# Altium schematic sheet P04_USB.SchDoc
size B; SheetNumber: 4; SheetTotal: 6
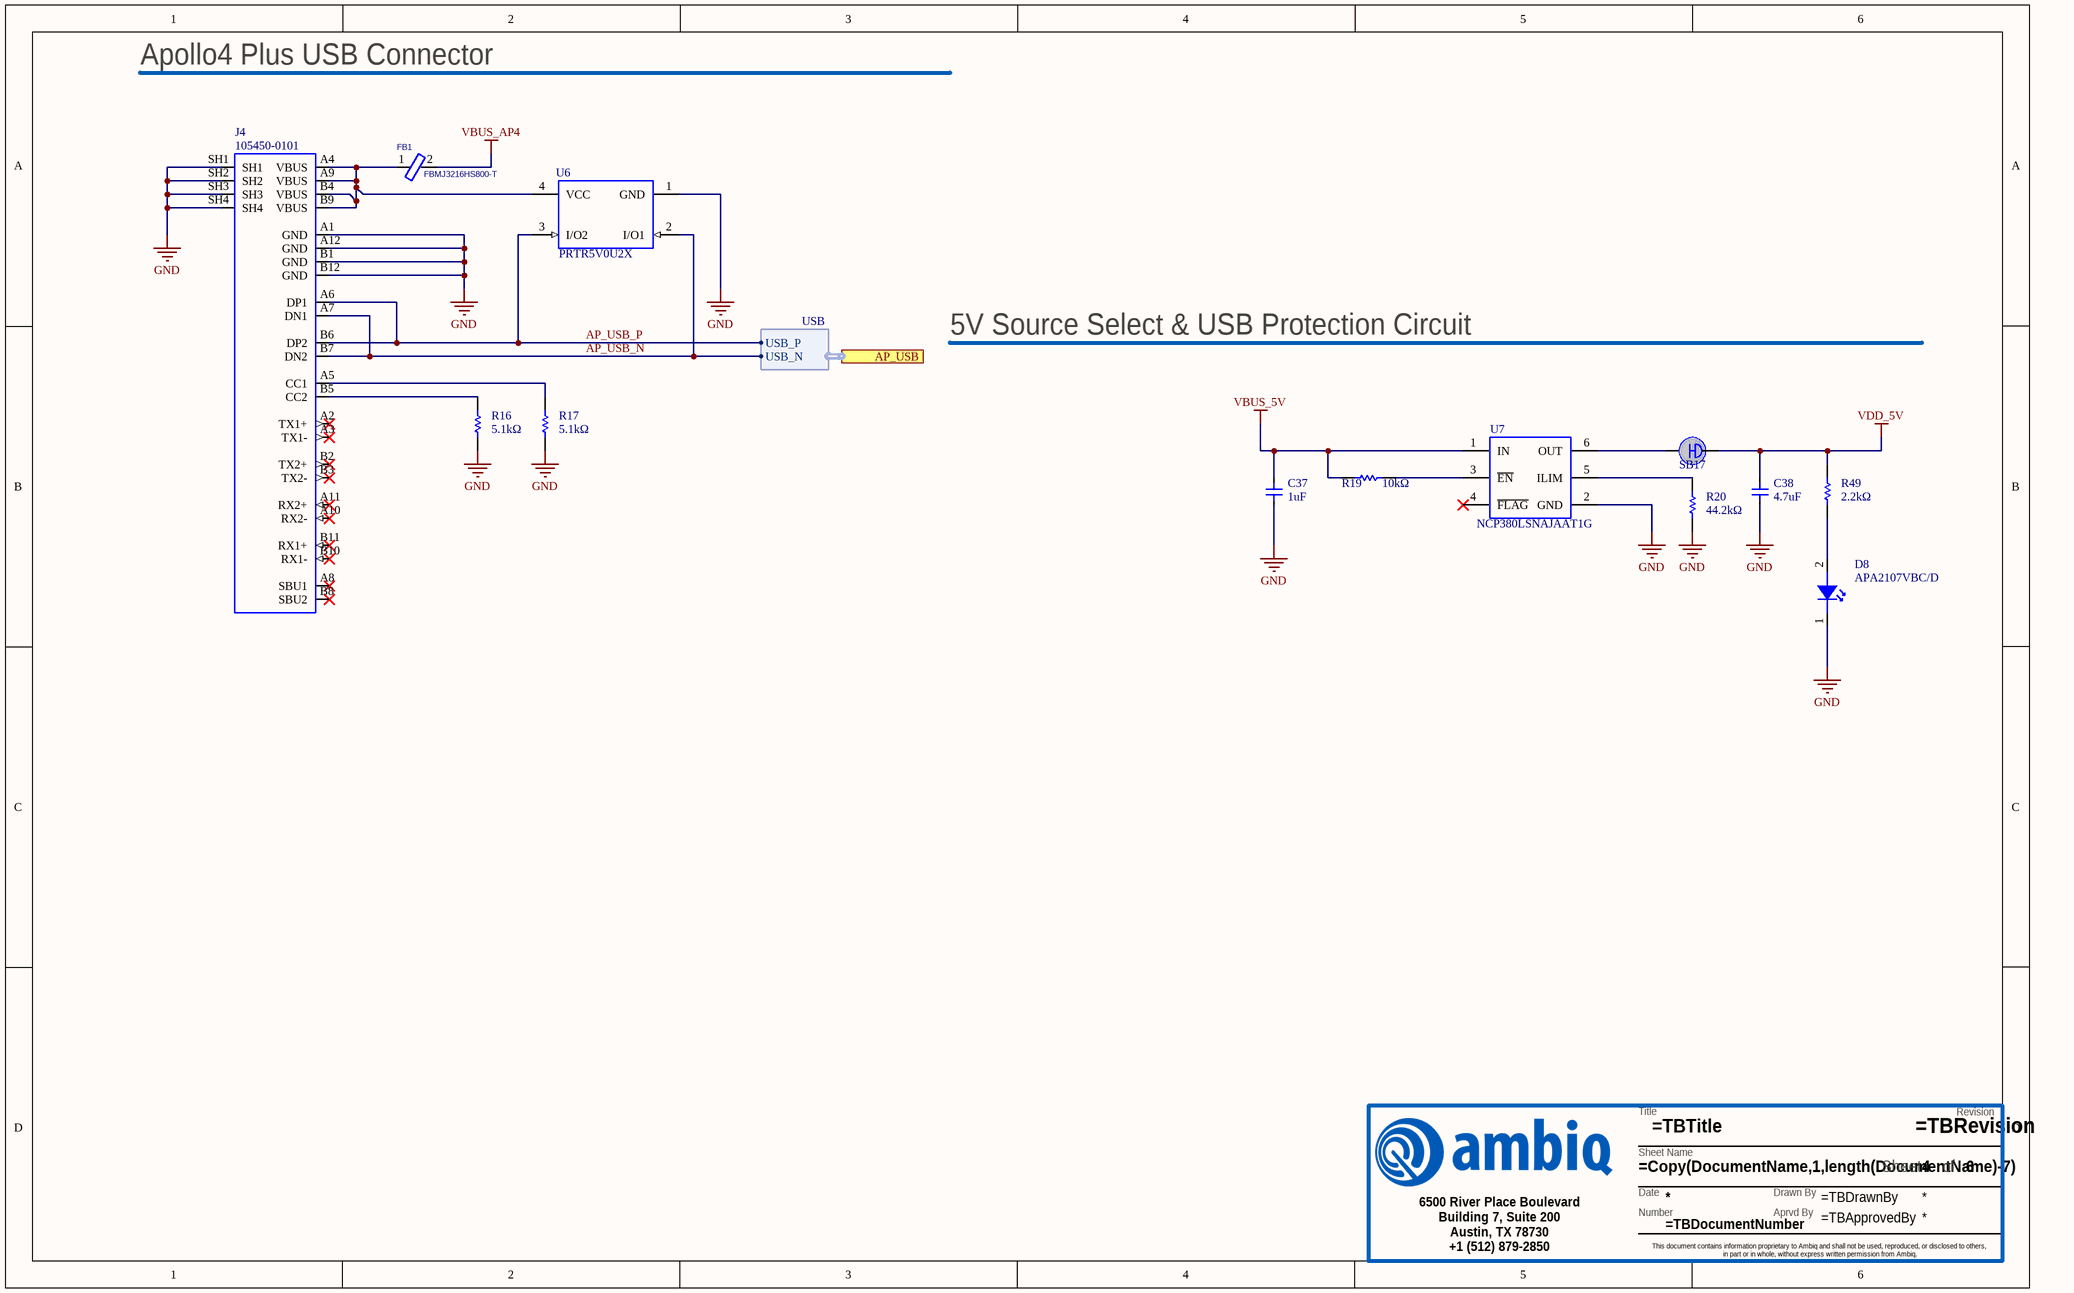
[diagram p0: P04_USB.SchDoc]

## Parts
?  TitleBlock  (value not drawn)  (graphical)
C37  1uF  [IPC_A]
C38  4.7uF  [IPC_A]
D8  APA2107VBC/D  [2106_LED_RA]
FB1  FBMJ3216HS800-T  [IPC_A]
J4  105450-0101  [CON24_C_USB_RA_TH]
R16  5.1kΩ  [IPC_A]
R17  5.1kΩ  [IPC_A]
R19  10kΩ  [IPC_A]
R20  44.2kΩ  [IPC_A]
R49  2.2kΩ  [IPC_A]
SB17  Solder short  [SB39X18_SHORTED]  (value not drawn)  (net tie, no BOM)
U6  PRTR5V0U2X  [SOT143L]
U7  NCP380LSNAJAAT1G  [TSOP6_1P70X3P10_ONS]

## Ports
AP_USB (harness USB)

## Harnesses
USB: USB_N, USB_P

## Nets
GND: C37.2 C38.2 D8.1(C) J4.A1(GND) J4.A12(GND) J4.B1(GND) J4.B12(GND) J4.SH1 J4.SH2 J4.SH3 J4.SH4 R16.1 R17.1 R20.1 U6.1(GND) U7.2(GND)
VBUS_5V: C37.1 R19.1 U7.1(IN)
VBUS_AP4: FB1.2
VDD_5V: C38.1 R49.2 SB17.2
AP_USB_N: J4.A7(DN1) J4.B7(DN2) U6.2(I/O1) ; port AP_USB.USB_N
AP_USB_P: J4.A6(DP1) J4.B6(DP2) U6.3(I/O2) ; port AP_USB.USB_P
NetD8_2: D8.2(A) R49.1
NetFB1_1: FB1.1 J4.A4(VBUS) J4.A9(VBUS) J4.B4(VBUS) J4.B9(VBUS) U6.4(VCC)
NetJ4_A5: J4.A5(CC1) R17.2
NetJ4_B5: J4.B5(CC2) R16.2
NetR19_2: R19.2 U7.3(~{EN})
NetR20_2: R20.2 U7.5(ILIM)
NetSB17_1: SB17.1 U7.6(OUT)

Not connected (* = marked no-connect by the designer): J4 A2(TX1+)* A3(TX1-)* A8(SBU1)* A10(RX2-)* A11(RX2+)* B2(TX2+)* B3(TX2-)* B8(SBU2)* B10(RX1-)* B11(RX1+)*; U7 4(~{FLAG})*

## Notes on the sheet
- Apollo4 Plus USB Connector
- 5V Source Select & USB Protection Circuit
- (in symbol TitleBlock) Revision; Title; Sheet Name; Sheet; of; Date; Drawn By; Number; Aprvd By; 6500 River Place Boulevard / Building 7, Suite 200 / Austin, TX 78730 / +1 (512) 879-2850; This document contains information proprietary to Ambiq and shall not be used, reproduced, or disclosed to others, / in part or in whole, without express written permission from Ambiq.

## Library data of the parts
? = TitleBlock: Title block for Ambiq Schematics. Please have the following parameters entered in Project>Project Options>Parameters: / TBTitle / TBDocumentNumber / TBRevision / TBDrawnBy / TBApprovedBy; AMBIQ PN: TitleBlock
C37 = CL05A105MP5NNNC: NONE; Manufacturer: Samsung; Tolerance: 20%; Voltage Rating: 10V; Dielectric: X5R; AMBIQ PN: CL05A105MP5NNNC; Supplier 1: Newark; Supplier Part Number 1: 82AC9187; Manufacturer Part Number: CL05A105MP5NNNC; RoHS: Yes; Category: Ceramic Capacitors; Pricing 1: 50000=0.10000 (USD); Mount: Surface Mount; Case/Package: 0402; Case Code (Metric): 1005; Case Code (Imperial): 0402; Min Operating Temperature: -55°C; Max Operating Temperature: 85°C; Capacitance: 1uF; Packaging: Tape and Reel; Voltage Rating (DC): 10V; Series: CL; Construction: Flat; Length: 1mm; Width: 0.02inch; Height: 0.5mm; Thickness: 0.022inch; Depth: 0.5mm; Radiation Hardening: No; Lead Free: Lead Free; RoHS Compliant: Yes; ComponentLink1URL: https://datasheet.ciiva.com/25802/cl05a105mp5nnnc-25802049.pdf?src-supplier=Digi-Key; ComponentLink1Description: https://datasheet.ciiva.com/25802/cl05a105mp5nnnc-25802049.pdf?src-supplier=Digi-Key; Package Quantity: 1
C38 = GRM155R60G475ME87D: NONE; Manufacturer: Murata; Tolerance: 20%; Voltage Rating: 4V; Dielectric: X5R; AMBIQ PN: GRM155R60G475ME87D; Supplier 1: Arrow Electronics; Supplier Part Number 1: GRM155R60G475ME87D; Manufacturer Part Number: GRM155R60G475ME87D; RoHS: Yes; Category: Ceramic Capacitors; Stock 1: 79890; Pricing 1: 1=0.12440, 10=0.07530, 25=0.07460, 100=0.04310, 250=0.04270, 500=0.02940, 1000=0.02580, 3000=0.02370, 6000=0.02210, 15000=0.021; Mount: Surface Mount; Case/Package: 0402; Case Code (Metric): 1005; Case Code (Imperial): 0402; Min Operating Temperature: -55°C; Max Operating Temperature: 85°C; Capacitance: 4.7uF; Packaging: Tape and Reel; Voltage: 4V; Voltage Rating (DC): 4V; Series: GRM; Construction: Flat; Length: 1mm; Width: 0.02inch; Height: 0.5mm; Thickness: 0.026inch; Depth: 0.5mm; Radiation Hardening: No; REACH SVHC: No SVHC; Lead Free: Lead Free; RoHS Compliant: Yes; ComponentLink1URL: https://datasheet.ciiva.com/11613/c02e-11613181.pdf?src-supplier=Avnet; ComponentLink1Description: https://datasheet.ciiva.com/11613/c02e-11613181.pdf?src-supplier=Avnet
D8 = APA2107VBC/D: None; Manufacturer: Kingbright; Forward Voltage: 3.3V; Color: Blue; Lens Color: Colorless; Luminous Intensity: 200mcd; Viewing Angle: 120°; Lens Style: Domed; Lens Transparency: Clear; Test Current: 20mA; Dominant Wavelength: 470nm; Lens Size: 0.6mm; AMBIQ PN: APA2107VBC/D; Supplier 1: Digi-Key; Supplier Part Number 1: 754-2102-1-ND; Manufacturer Part Number: APA2107VBC/D; RoHS: Yes; Category: LEDs; Stock 1: 6712; Pricing 1: 1=0.61000, 10=0.37500, 100=0.21560, 1000=0.16871 (USD); Case/Package: SMD/SMT; Packaging: Tape and Reel; Length: 2.1mm; Width: 1mm; Height: 0.7mm; RoHS Compliant: Yes; ComponentLink1URL: http://www.kingbrightusa.com/images/catalog/SPEC/APA2107VBC-D.pdf?src-supplier=Digi-Key; ComponentLink1Description: http://www.kingbrightusa.com/images/catalog/SPEC/APA2107VBC-D.pdf?src-supplier=Digi-Key; Mount: Surface Mount
FB1 = FBMJ3216HS800-T: NONE; Manufacturer: Taiyo Yuden; Impedance: 80R; Tolerance: 25%; DC Resistance (DCR): 10mR; Max DC Current: 4A; Number of Lines: 1; Test Frequency: 100MHz; Shielding: Unshielded; AMBIQ PN: FBMJ3216HS800-T; Supplier 1: Newark; Supplier Part Number 1: 86H5353; Manufacturer Part Number: FBMJ3216HS800-T; RoHS: Yes; Category: Ferrite Beads and Chips; Stock 1: 265; Pricing 1: 1=0.30000, 10=0.20700, 25=0.17700, 50=0.14800, 100=0.11800 (USD); ComponentLink1URL: https://datasheet.ciiva.com/5709/chipbeads01-e-5709344.pdf?src-supplier=Farnell; ComponentLink1Description: https://datasheet.ciiva.com/5709/chipbeads01-e-5709344.pdf?src-supplier=Farnell; Mount: Surface Mount; Case/Package: 1206; Number of Pins: 2; Core Material: Ferrite; Case Code (Metric): 3216; Case Code (Imperial): 1206; Material: Ferrite; Min Operating Temperature: -40°C; Max Operating Temperature: 125°C; Packaging: Tape and Reel; Resistance: 10mR; Package Quantity: 1; Max Current Rating: 4A; Termination: SMD/SMT; Frequency: 100MHz; Series: FB; Resistor Type: Ferrite Bead; Length: 3.2mm; Width: 0.063inch; Height: 1.3mm; Depth: 1.8mm; Lead Free: Lead Free; Halogen Free: Halogen Free; REACH SVHC: No SVHC; ComponentLink2URL: https://datasheet.ciiva.com/16001/202fbmj3216hs800-t-16001070.pdf?src-supplier=Onlinecomponents.com; ComponentLink2Description: https://datasheet.ciiva.com/16001/202fbmj3216hs800-t-16001070.pdf?src-supplier=Onlinecomponents.com; ComponentLink3URL: https://datasheet.ciiva.com/30088/23fbmj3216hs800-t-30088710.pdf?src-supplier=Onlinecomponents.com; ComponentLink3Description: https://datasheet.ciiva.com/30088/23fbmj3216hs800-t-30088710.pdf?src-supplier=Onlinecomponents.com; ComponentLink4URL: https://datasheet.ciiva.com/23606/fbmj3216hs800-t-ss-23606768.pdf?src-supplier=Newark; ComponentLink4Description: https://datasheet.ciiva.com/23606/fbmj3216hs800-t-ss-23606768.pdf?src-supplier=Newark; ComponentLink5URL: https://datasheet.ciiva.com/25614/0900766b810b37be-25614395.pdf?src-supplier=RSComponents; ComponentLink5Description: https://datasheet.ciiva.com/25614/0900766b810b37be-25614395.pdf?src-supplier=RSComponents; ComponentLink6URL: https://datasheet.ciiva.com/6212/chipbeads01-e-6212909.pdf?src-supplier=Digi-Key; ComponentLink6Description: https://datasheet.ciiva.com/6212/chipbeads01-e-6212909.pdf?src-supplier=Digi-Key; ComponentLink7URL: https://datasheet.ciiva.com/7966/chipbeads01-e-7966171.pdf?src-supplier=Element14; ComponentLink7Description: https://datasheet.ciiva.com/7966/chipbeads01-e-7966171.pdf?src-supplier=Element14
J4 = 1054500101: NONE; Manufacturer: Molex; Number of Terminals/Pins: 24; Connector Type: USB; Gender: Receptacle; Number of Ports: 1; USB Standard: USB 3.1; Current Rating: 5A; Mating Cycles: 10000; Shielding: Shielded; Pitch: 0.5mm; AMBIQ PN: 1054500101; Supplier 1: Arrow Electronics; Supplier Part Number 1: 105450-0101; Manufacturer Part Number: 105450-0101; RoHS: Yes; Category: USB Connectors; Stock 1: 534; Pricing 1: 1=2.15670, 10=1.78070, 25=1.76290, 100=1.52500, 250=1.50710, 500=1.41880 (USD); Mount: Surface Mount,Through Hole,Horizontal; Case/Package: 0101; Number of Pins: 24; Contact Material: Copper Alloy; Contact Plating: Gold; Housing Material: Thermoplastic; Insulation Color: Black; Min Operating Temperature: -30°C; Max Operating Temperature: 85°C; Packaging: Tape and Reel; Number of Contacts: 24; Orientation: Right Angle; Termination: Solder; Features: Shielded; Length: 8.94mm; REACH SVHC: Unknown; Flammability Rating: UL94 V-0; RoHS Compliant: Yes; ComponentLink1URL: http://www.farnell.com/datasheets/2801634.pdf?src-supplier=Farnell; ComponentLink1Description: http://www.farnell.com/datasheets/2801634.pdf?src-supplier=Farnell
R16 R17 = CRCW04025K10FKED: Res Thick Film 0402 5.1K Ohm 1% 1/16W ±100ppm/°C Molded SMD SMD Paper T/R; Manufacturer: Vishay; Power Rating: 63mW; Voltage Rating: 50V; AMBIQ PN: CRCW04025K10FKED; Supplier 1: RSComponents; Supplier Part Number 1: 6789478P; Manufacturer Part Number: CRCW04025K10FKED; RoHS: Yes; Category: Chip SMD Resistors; Stock 1: 1; Pricing 1: 50=0.06400, 500=0.05900, 1000=0.05300, 2000=0.04700, 4000=0.04100 (USD); Mount: Surface Mount; Case/Package: 0402; Weight: 2.3E-05oz; Case Code (Metric): 1005; Case Code (Imperial): 0402; Contact Plating: Tin; Size Code: 0402; Min Operating Temperature: -55°C; Max Operating Temperature: 155°C; Resistance: 5.1kΩ; Package Quantity: 10; Packaging: Tape and Reel; Resistor Type: Thick Film; Number of Terminations: 2; Termination: SMD/SMT; Max Power Dissipation: 63mW; Temperature Coefficient: 100ppm/°C; Voltage Rating (DC): 50V; Features: Automotive AEC-Q200; Series: CRCW; Technology: THICK FILM; Construction: Rectangular; Length: 1mm; Width: 0.02inch; Height: 0.35mm; Depth: 0.5mm; Radiation Hardening: No; REACH SVHC: Unknown; Military Standard: Not; Lead Free: Lead Free; RoHS Compliant: Yes; ComponentLink1URL: https://datasheet.ciiva.com/11809/0900766b80d98824-11809770.pdf?src-supplier=RSComponents; ComponentLink1Description: https://datasheet.ciiva.com/11809/0900766b80d98824-11809770.pdf?src-supplier=RSComponents; ComponentLink2URL: https://datasheet.ciiva.com/2464/dcrcwe3-2464033.pdf?src-supplier=Digi-Key; ComponentLink2Description: https://datasheet.ciiva.com/2464/dcrcwe3-2464033.pdf?src-supplier=Digi-Key; ComponentLink3URL: https://datasheet.ciiva.com/2464/dcrcwe3-2464034.pdf?src-supplier=Digi-Key; Tolerance: 1%; Resistance Tolerance: 1%; ComponentLink3Description: https://datasheet.ciiva.com/2464/dcrcwe3-2464034.p; ComponentLink4URL: https://datasheet.ciiva.com/2464/dcrcwe3-2464035.p; ComponentLink4Description: https://datasheet.ciiva.com/2464/dcrcwe3-2464035.p; ComponentLink5URL: https://datasheet.ciiva.com/3256/dcrcwe3-3256680.p; ComponentLink5Description: https://datasheet.ciiva.com/3256/dcrcwe3-3256680.p; ComponentLink6URL: https://datasheet.ciiva.com/7690/1697337-7690682.p; ComponentLink6Description: https://datasheet.ciiva.com/7690/1697337-7690682.p; ComponentLink7URL: https://datasheet.ciiva.com/7690/1697337-7690683.p; ComponentLink7Description: https://datasheet.ciiva.com/7690/1697337-7690683.p; ComponentLink8URL: https://datasheet.ciiva.com/22675/1847332-22675086; ComponentLink8Description: https://datasheet.ciiva.com/22675/1847332-22675086; ComponentLink9URL: https://datasheet.ciiva.com/7172/1635184-7172981.p; ComponentLink9Description: https://datasheet.ciiva.com/7172/1635184-7172981.p
R19 = RC0402FR-0710KL: Surface Mount Thick Film Resistor, Rc Series, 10 Kohm, 62.5 Mw, - 1%, 50 V, 0402 [1005 Metric]; Manufacturer: Yageo; Resistance: 10kR; Power Rating: 62.5mW; Voltage Rating: 50V; Max Power Dissipation: 63mW; Temperature Coefficient: 100ppm/°C; AMBIQ PN: RC0402FR-0710KL; Supplier 1: Arrow Electronics; Supplier Part Number 1: RC0402FR-0710KL; Manufacturer Part Number: RC0402FR-0710KL; RoHS: Yes; Category: Chip SMD Resistors; Stock 1: 7776428; Pricing 1: 10000=0.00210 (USD); Case/Package: 0402; Case Code (Metric): 1005; Case Code (Imperial): 0402; Min Operating Temperature: -55°C; Max Operating Temperature: 155°C; Packaging: Tape and Reel; Resistor Type: Thick Film; Number of Terminations: 2; Termination: SMD/SMT; Voltage Rating (DC): 50V; Features: Moisture Resistant; Series: RC; Construction: Rectangular; Length: 1mm; Width: 0.5mm; Height: 0.32mm; Depth: 0.5mm; REACH SVHC: No SVHC; Military Standard: Not; Lead Free: Lead Free; RoHS Compliant: Yes; ComponentLink1URL: https://datasheet.ciiva.com/7660/38568-7660787.pdf?src-supplier=Element14; ComponentLink1Description: https://datasheet.ciiva.com/7660/38568-7660787.pdf?src-supplier=Element14; ComponentLink2URL: https://datasheet.ciiva.com/7849/1686128-7849814.pdf?src-supplier=Element14; ComponentLink2Description: https://datasheet.ciiva.com/7849/1686128-7849814.pdf?src-supplier=Element14; ComponentLink3URL: https://datasheet.ciiva.com/7983/1018594-7983486.pdf?src-supplier=Element14; Tolerance: 1%; Number of Pins: 2; Resistance Tolerance: 1%; Working Voltage: 50V; Lead Pitch: 0.2mm
R20 = CRCW040244K2FKED: Res Thick Film 0402 44.2K Ohm 1% 1/16W ±100ppm/°C Molded SMD SMD Paper T/R; Manufacturer: Vishay; Resistance: 44.2kR; Power Rating: 63mW; Voltage Rating: 50V; AMBIQ PN: CRCW040244K2FKED; Supplier 1: RSComponents; Supplier Part Number 1: 6789336; Manufacturer Part Number: CRCW040244K2FKED; RoHS: Yes; Category: Chip SMD Resistors; Stock 1: 1300; Pricing 1: 50=0.05000, 500=0.04600, 1000=0.04300, 2000=0.04000, 4000=0.03700 (GBP); Mount: Surface Mount; Case/Package: 0402; Weight: 2.3E-05oz; Case Code (Metric): 1005; Case Code (Imperial): 0402; Contact Plating: Tin; Size Code: 0402; Min Operating Temperature: -55°C; Max Operating Temperature: 155°C; Package Quantity: 10; Packaging: Tape and Reel; Resistor Type: Thick Film; Number of Terminations: 2; Termination: SMD/SMT; Max Power Dissipation: 63mW; Temperature Coefficient: 100ppm/°C; Voltage Rating (DC): 50V; Features: Automotive AEC-Q200; Series: CRCW; Technology: THICK FILM; Construction: Rectangular; Length: 1mm; Width: 0.5mm; Height: 0.35mm; Depth: 0.5mm; Radiation Hardening: No; REACH SVHC: Unknown; Military Standard: Not; Lead Free: Lead Free; RoHS Compliant: Yes; ComponentLink1URL: https://datasheet.ciiva.com/11809/0900766b80d98824-11809017.pdf?src-supplier=RSComponents; ComponentLink1Description: https://datasheet.ciiva.com/11809/0900766b80d98824-11809017.pdf?src-supplier=RSComponents; ComponentLink2URL: https://datasheet.ciiva.com/2463/dcrcwe3-2463784.pdf?src-supplier=Digi-Key; ComponentLink2Description: https://datasheet.ciiva.com/2463/dcrcwe3-2463784.pdf?src-supplier=Digi-Key; ComponentLink3URL: https://datasheet.ciiva.com/3256/dcrcwe3-3256534.pdf?src-supplier=Avnet; Tolerance: 1%; Number of Pins: 2; Resistance Tolerance: 1%; ComponentLink3Description: https://datasheet.ciiva.com/3256/dcrcwe3-3256534.p; ComponentLink4URL: https://datasheet.ciiva.com/2463/dcrcwe3-2463785.p; ComponentLink4Description: https://datasheet.ciiva.com/2463/dcrcwe3-2463785.p; ComponentLink5URL: https://datasheet.ciiva.com/2463/dcrcwe3-2463786.p; ComponentLink5Description: https://datasheet.ciiva.com/2463/dcrcwe3-2463786.p; ComponentLink6URL: https://datasheet.ciiva.com/3256/dcrcwe3-3256533.p; ComponentLink6Description: https://datasheet.ciiva.com/3256/dcrcwe3-3256533.p; ComponentLink7URL: https://datasheet.ciiva.com/7671/1697337-7671605.p; ComponentLink7Description: https://datasheet.ciiva.com/7671/1697337-7671605.p; ComponentLink8URL: https://datasheet.ciiva.com/7671/1697337-7671606.p; ComponentLink8Description: https://datasheet.ciiva.com/7671/1697337-7671606.p; ComponentLink9URL: https://datasheet.ciiva.com/22870/70201119-2287034; ComponentLink9Description: https://datasheet.ciiva.com/22870/70201119-2287034; ComponentLink10URL: https://datasheet.ciiva.com/16768/70201119-1676858; ComponentLink10Description: https://datasheet.ciiva.com/16768/70201119-1676858
R49 = RC0402FR-072K2L: Res Thick Film 1.0 x 0.5 mm 2.2K Ohm 1% 0.063W(1/16W) 100ppm/ C Molded SMD Paper T/R; Manufacturer: Yageo; Resistance: 2.2kR; Power Rating: 63mW; Voltage Rating: 50V; Temperature Coefficient: 100ppm/°C; AMBIQ PN: RC0402FR-072K2L; Supplier 1: Arrow Electronics; Supplier Part Number 1: RC0402FR-072K2L; Manufacturer Part Number: RC0402FR-072K2L; RoHS: Yes; Category: Chip SMD Resistors; Stock 1: 3540000; Pricing 1: 10000=0.00090 (USD); Case/Package: 0402; Weight: 2.3E-05oz; Case Code (Metric): 1005; Case Code (Imperial): 0402; Size Code: 0402; Min Operating Temperature: -55°C; Max Operating Temperature: 155°C; Packaging: Tape and Reel; Resistor Type: Thick Film; Number of Terminations: 2; Termination: SMD/SMT; Max Power Dissipation: 63mW; Features: Moisture Resistant; Series: RC; Technology: THICK FILM; Construction: Rectangular; Length: 1mm; Width: 0.5mm; Height: 0.35mm; Depth: 0.5mm; REACH SVHC: Unknown; Military Standard: Not; Lead Free: Lead Free; RoHS Compliant: Yes; ComponentLink1URL: https://datasheet.ciiva.com/11808/0900766b80c66297-11808786.pdf?src-supplier=RSComponents; ComponentLink1Description: https://datasheet.ciiva.com/11808/0900766b80c66297-11808786.pdf?src-supplier=RSComponents; ComponentLink2URL: https://datasheet.ciiva.com/7983/1018594-7983515.pdf?src-supplier=Element14; ComponentLink2Description: https://datasheet.ciiva.com/7983/1018594-7983515.pdf?src-supplier=Element14; ComponentLink3URL: https://datasheet.ciiva.com/46383/1018594-46383563.pdf?src-supplier=Element14; Tolerance: 1%; Resistance Tolerance: 1%
SB17 = SBS: None; AMBIQ PN: SBS
U6 = PRTR5V0U2X,215: None; Manufacturer: Nexperia; AMBIQ PN: PRTR5V0U2X,215; Manufacturer Part Number: PRTR5V0U2X,215; Supplier 1: Arrow Electronics; Supplier Part Number 1: PRTR5V0U2X,215; RoHS: Yes; Category: ESD and Circuit Protection ICs; Stock 1: 234000; Pricing 1: 3000=0.18050, 6000=0.16890, 15000=0.15880 (USD); RoHS Compliant: Yes; ComponentLink1URL: http://www.farnell.com/datasheets/109718.pdf?src-supplier=Farnell; ComponentLink1Description: http://www.farnell.com/datasheets/109718.pdf?src-supplier=Farnell; ComponentLink2URL: https://assets.nexperia.com/documents/data-sheet/PRTR5V0U2X.pdf?src-supplier=Digi-Key; ComponentLink2Description: https://assets.nexperia.com/documents/data-sheet/PRTR5V0U2X.pdf?src-supplier=Digi-Key
U7 = NCP380LSNAJAAT1G: None; Manufacturer: ON Semiconductor; Interface: On/Off; Number of Outputs: 1; Max Output Current: 1A; Output Configuration: High Side; Max Power Dissipation: 350mW; Current Rating: 2.1A; On-State Resistance: 70mR; On-state Resistance-Max: 110MR; Operating Supply Voltage: 5.5V; Min Input Voltage: 2.5V; Number of Inputs: 2; Turn-On Delay Time: 4ms; Turn-Off Delay Time: 3ms; AMBIQ PN: NCP380LSNAJAAT1G; Manufacturer Part Number: NCP380LSNAJAAT1G; Supplier 1: Newark; Supplier Part Number 1: 42Y0754; RoHS: Yes; Category: USB Interface ICs; Stock 1: 1700; Pricing 1: 1=0.83000, 10=0.73100, 25=0.68600, 50=0.62300, 100=0.56000, 250=0.52000, 500=0.44300, 1000=0.35400 (USD); Number of Pins: 6; Min Operating Temperature: -40°C; Max Operating Temperature: 85°C; Package Quantity: 1; Packaging: Tape and Reel; Series: -; Mount: Surface Mount; Length: 3mm; Width: 1.5mm; Height: 1mm; Number of Switches: 1; Rated Current-Max: 2.1A; Max Input Voltage: 5.5V; Case/Package: TSOP; Radiation Hardening: No